# EAGLE schematic brick_analog_mic (EAGLE 7.4.0)
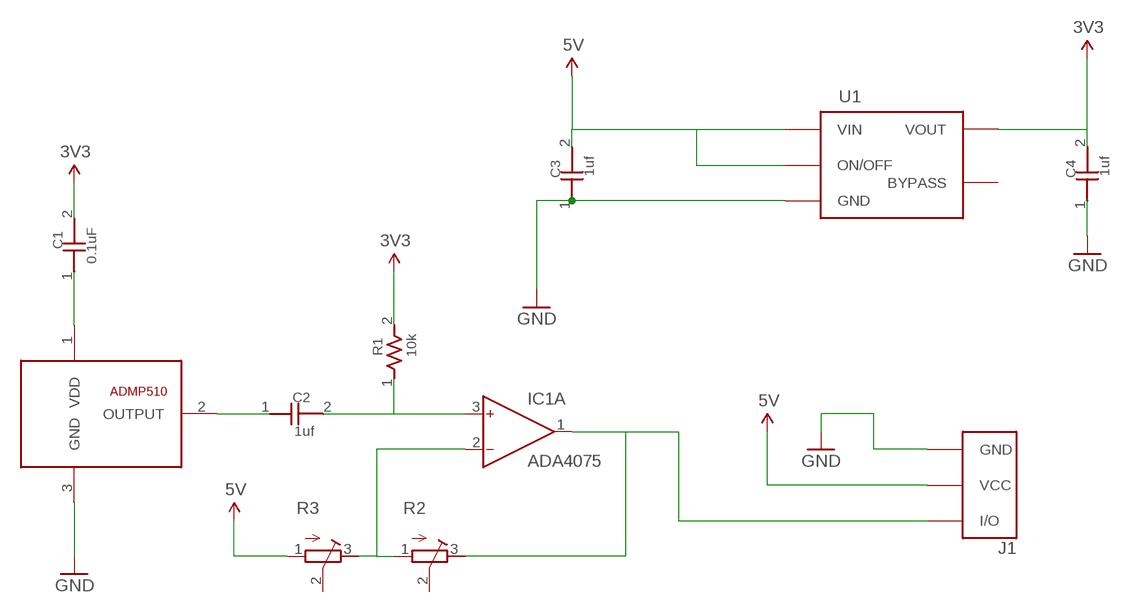
[diagram p0: schematic, sheet 1]

## Parts
C1  0.1uF  CAPACITOR0603  [0603]
C2  1uf  CAPACITOR0603  [0603]
C3  1uf  CAPACITOR0603  [0603]
C4  1uf  CAPACITOR0603  [0603]
IC1  ADA4075  ADA4075-2R  [SO8]
J1  FABO_BRICK_3PIN  [FABO_BRICK_3PIN]
R1  10k  RESISTOR0603  [0603]
R2  R-TRIMM3202  [RTRIM3202]
R3  R-TRIMM3202  [RTRIM3202]
U1  LP2985-33DBVR  [SOT_23_5]
U$1  ANALOGDEVICES-ADMP510  [ANALOGDEVICES-ADMP510]

## Nets
3V3: C1.2 C4.2 R1.2 U1.5(VOUT)
5V: C3.2 J1.VCC R3.1(A) U1.1(VIN) U1.3(ON/OFF)
GND: C3.1 C4.1 J1.GND U1.2(GND) U$1.3(GND)
N$1: C2.1 U$1.2(OUTPUT)
N$2: C2.2 IC1.3(A:IN+) R1.1
N$3: IC1.1(A:OUT) J1.IN/OUT(I/O) R2.3(E)
N$4: IC1.2(A:IN-) R2.1(A) R3.3(E)
N$5: C1.1 U$1.1(VDD)
Unconnected: IC1.5(B:IN+) IC1.6(B:IN-) IC1.7(B:OUT) R2.2(S) R3.2(S) U1.4(BYPASS)

## Power pins joined to a net without a drawn wire
V+: IC1.8(P:V+)
V-: IC1.4(P:V-)

## Library data of the parts
C1 C2 = FaBo-Capacitor:CAPACITOR
C3 C4 = GClue-Capacitor:CAPACITOR
IC1 = analog-devices:ADA4075-2: Ultralow Noise Amplifier at Lower Power Source: http://www.analog.com/static/imported-files/data_sheets/ADA4075-2.pdf; MPN: ADA4075-2ARZ; OC_FARNELL: 1701254; OC_NEWARK: 19P8164
J1 = FaBo-Template:FABO_BRICK_3PIN: FaBo Brick 3pin
R1 = FaBo-Resistors:RESISTOR
R2 R3 = rcl:R-TRIMM: Trimm resistor
U1 = FaBo-Supply:LP2985: LP2985 IC REG LDO 3.3V 0.15 A
U$1 = FaBo-Mems:ANALOGDEVICES-ADMP510